# EasyEDA Pro project design.epro

# Schematic Schematic1
Board Name: Board1; Create Date: 2025-04-21; Page Name: P1; Project Name: EEPROM_PROG; Schematic Name: Schematic1; Update Date: 2025-04-21; Company: EasyEDA.com; Page Size: A4; Version: V1.0
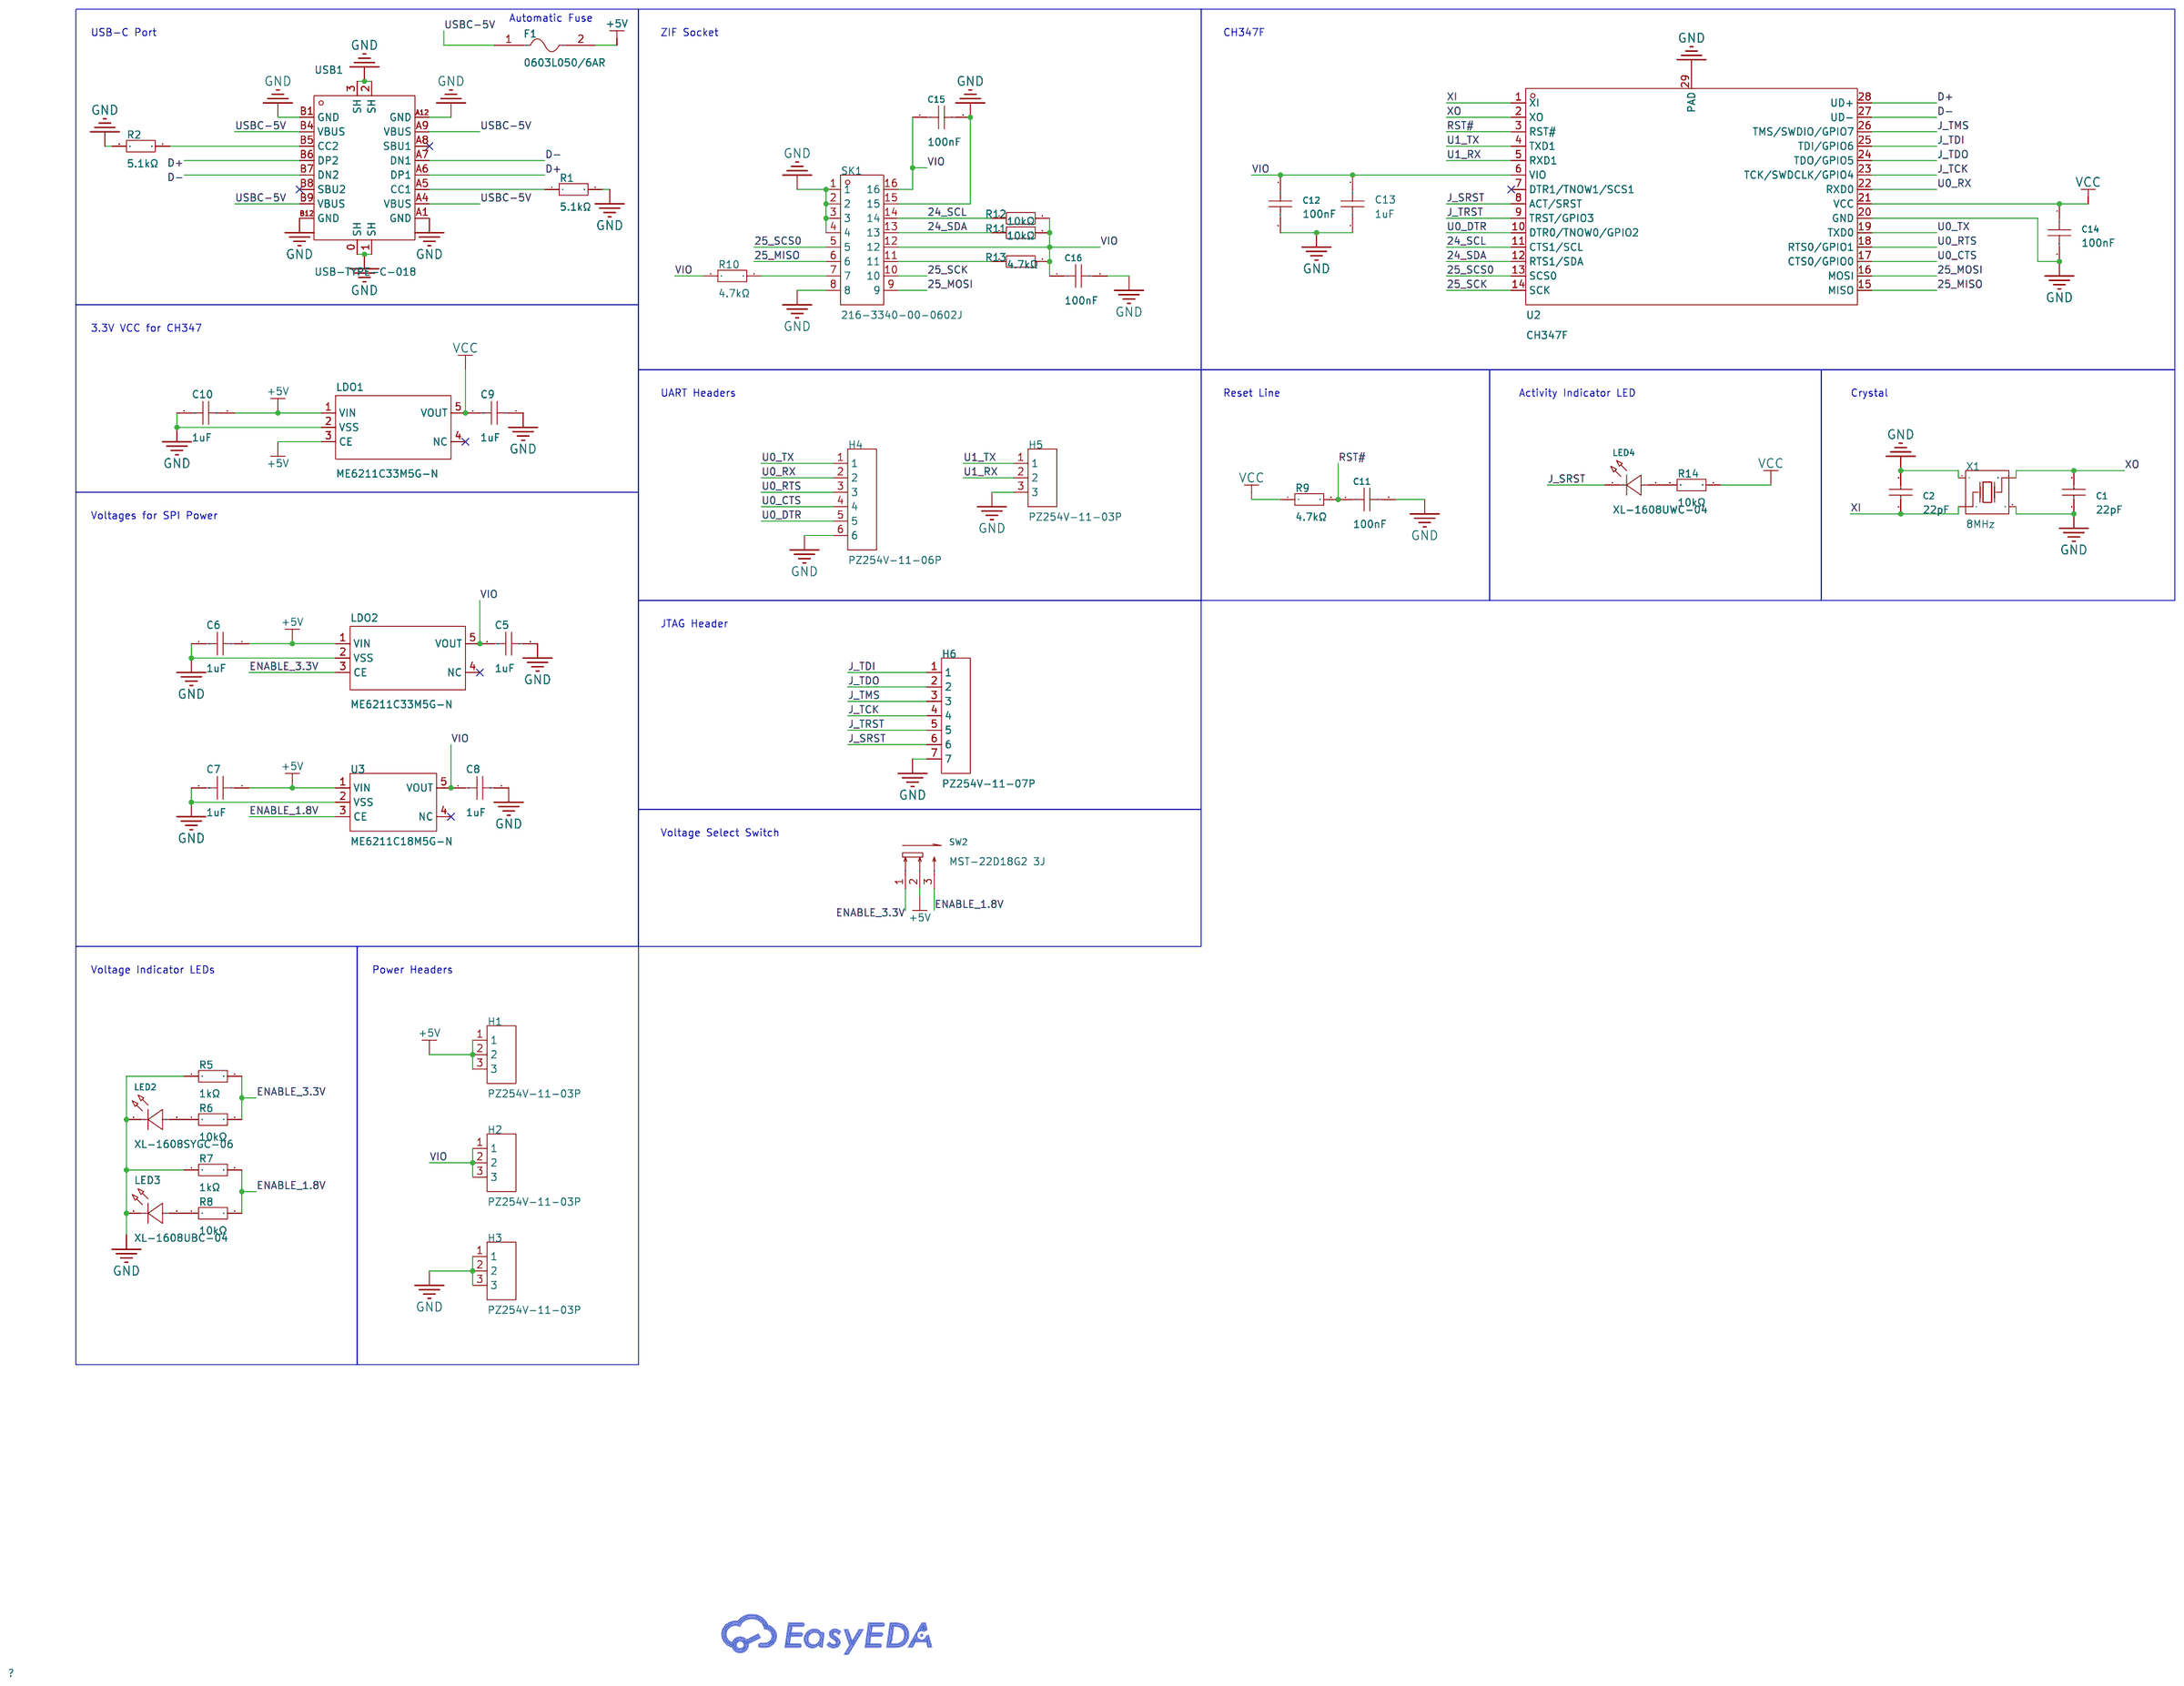
[diagram p0: schematic sheet]

## Parts
C1  22pF  [C0402]
C2  22pF  [C0402]
C5  1uF  [C0603]
C6  1uF  [C0603]
C7  1uF  [C0603]
C8  1uF  [C0603]
C9  1uF  [C0603]
C10  1uF  [C0603]
C11  100nF  [C0603]
C12  100nF  [C0603]
C13  1uF  [C0603]
C14  100nF  [C0603]
C15  100nF  [C0603]
C16  100nF  [C0603]
F1  0603L050/6AR  [F0603]
H1  PZ254V-11-03P  [HDR-TH_3P-P2.54-V-M]
H2  PZ254V-11-03P  [HDR-TH_3P-P2.54-V-M]
H3  PZ254V-11-03P  [HDR-TH_3P-P2.54-V-M]
H4  PZ254V-11-06P  [HDR-TH_6P-P2.54-V-M]
H5  PZ254V-11-03P  [HDR-TH_3P-P2.54-V-M]
H6  PZ254V-11-07P  [HDR-TH_7P-P2.54-V-M]
LDO1  ME6211C33M5G-N  [SOT-23-5_L3.0-W1.7-P0.95-LS2.8-BL]
LDO2  ME6211C33M5G-N  [SOT-23-5_L3.0-W1.7-P0.95-LS2.8-BL]
LED2  XL-1608SYGC-06  [LED0603-RD_GREEN]
LED3  XL-1608UBC-04  [LED0603-RD_BLUE]
LED4  XL-1608UWC-04  [LED0603-RD_WHITE]
R1  5.1kΩ  [R0603]
R2  5.1kΩ  [R0603]
R5  1kΩ  [R0603]
R6  10kΩ  [R0603]
R7  1kΩ  [R0603]
R8  10kΩ  [R0603]
R9  4.7kΩ  [R0603]
R10  4.7kΩ  [R0603]
R11  10kΩ  [R0603]
R12  10kΩ  [R0603]
R13  4.7kΩ  [R0603]
R14  10kΩ  [R0603]
SK1  216-3340-00-0602J  [DIP-16_216-3340-00-0602J]
SW2  MST-22D18G2 3J  [SW-SMD_SHOUHAN_MST-22D18G23J_C2875122]
U2  CH347F  [QFN-28_L4.0-W4.0-P0.40-BL-EP2.7]
U3  ME6211C18M5G-N  [SOT-23-5_L3.0-W1.7-P0.95-LS2.8-BR]
USB1  USB-TYPE-C-018  [USB-C_SMD-TYPE-C-31-M-12]
X1  8MHz  [CRYSTAL-SMD_4P-L3.2-W2.5-BL]

## Library data of the parts
C1 C2 = CC0402JRNPO9BN220: Capacitance: Tolerance:±5% Tolerance:±5% Voltage Rated: Temperature Coefficient:; LCSC Part Name: 22pF ±5% 50V; Supplier Part: C106203; Manufacturer: YAGEO(国巨); Supplier Footprint: 0402; JLCPCB Part Class: Extended Part; Datasheet: https://atta.szlcsc.com/upload/public/pdf/source/20170505/1493957838062.pdf; Supplier: LCSC; Tolerance: ±5%
C5-C10 C13 = CL10A105KB8NNNC: Capacitance: Tolerance:±10% Tolerance:±10% Voltage Rated: Temperature Coefficient:; LCSC Part Name: 1uF ±10% 50V; Supplier Part: C15849; Manufacturer: SAMSUNG(三星); Supplier Footprint: 0603; JLCPCB Part Class: Basic Part; Datasheet: https://atta.szlcsc.com/upload/public/pdf/source/20160218/1457707763339.pdf; Supplier: LCSC; Tolerance: ±10%
C11 C12 C14-C16 = CL10B104KB8NNNC: Capacitance: Tolerance:±10% Tolerance:±10% Voltage Rated: Temperature Coefficient:; LCSC Part Name: 100nF ±10% 50V; Supplier Part: C1591; Manufacturer: SAMSUNG(三星); Supplier Footprint: 0603; JLCPCB Part Class: Extended Part; Datasheet: https://atta.szlcsc.com/upload/public/pdf/source/20160218/1457707763339.pdf; Supplier: LCSC; Tolerance: ±10%
F1 = 0603L050/6AR: Operating Voltage (Max):6V Current Rating (Max):40A Hold Current:500mA Trip Current:1A Power Dissipation:500mW Resistance - Initial (Ri) (Min):100mΩ Resistance - Post Trip (R1) (Max):800mΩ Maximum Time to Trip:100ms Operating Temperature:-40℃~+85℃ Operati; LCSC Part Name: 6V 500mA 0603自恢复; Supplier Part: C7472536; Manufacturer: LUTE(陆特); Supplier Footprint: 0603; JLCPCB Part Class: Extended Part; Datasheet: https://atta.szlcsc.com/upload/public/pdf/source/20230807/696632CDD396EBD91087F7A9C6D2528B.pdf; Supplier: LCSC; Operating Voltage (Max): 6V; Current Rating (Max): 40A; Hold Current: 500mA; Trip Current: 1A; Power Dissipation: 500mW; Resistance - Initial (Ri) (Min): 100mΩ; Resistance - Post Trip (R1) (Max): 800mΩ; Maximum Time to Trip: 100ms; Operating Temperature: -40℃~+85℃
H1-H3 H5 = PZ254V-11-03P: Pin Structure:1x3P Pitch:2.54mm Row Spacing:- Circluar Pins/Square Pins:Policy Mounting Type:Straight Number of Rows:Single Row Number of Pins:3P Current Rating:3A Voltage Rating (Max):250V Length of Mating Pin:6mm Insulation Height:2.5mm Length of End Co; LCSC Part Name: 1x3P 间距:2.54mm 方针 直插; Supplier Part: C2937625; Manufacturer: XFCN(兴飞); Supplier Footprint: 插件,P=2.54mm; JLCPCB Part Class: Extended Part; Datasheet: https://atta.szlcsc.com/upload/public/pdf/source/20200309/C492402_8335C3D49C4E4C618838D59BB1D024C1.pdf; Supplier: LCSC; Pin Structure: 1x3P; Pitch: 2.54mm; Circluar Pins/Square Pins: Policy; Mounting Type: Straight; Number of Rows: Single Row; Number of Pins: 3P; Current Rating: 3A; Voltage Rating (Max): 250V; Length of Mating Pin: 6mm; Insulation Height: 2.5mm; Length of End Connection Pin: 3mm; Operating Temperature: -40℃~+105℃; Color: Black
H4 = PZ254V-11-06P: Pin Structure:1x6P Pitch:2.54mm Row Spacing:- Circluar Pins/Square Pins:Policy Mounting Type:Straight Number of Rows:Single Row Number of Pins:6P Current Rating:- Voltage Rating (Max):- Length of Mating Pin:6mm Insulation Height:2.5mm Length of End Connec; LCSC Part Name: 1x6P 间距:2.54mm 方针 直插; Supplier Part: C492405; Manufacturer: XFCN(兴飞); Supplier Footprint: 插件,P=2.54mm; JLCPCB Part Class: Extended Part; Datasheet: https://atta.szlcsc.com/upload/public/pdf/source/20200309/C492405_597F1930F5B55CC3C7FD95458F1C3977.pdf; Supplier: LCSC; Pin Structure: 1x6P; Pitch: 2.54mm; Circluar Pins/Square Pins: Policy; Mounting Type: Straight; Number of Rows: Single Row; Number of Pins: 6P; Length of Mating Pin: 6mm; Insulation Height: 2.5mm; Length of End Connection Pin: 3mm; Contact Material: Brass; Operating Temperature: -40℃~+105℃; Color: Black
H6 = PZ254V-11-07P: Pin Structure:1x7P Pitch:2.54mm Row Spacing:- Circluar Pins/Square Pins:Policy Mounting Type:Straight Number of Rows:Single Row Number of Pins:7P Current Rating:- Voltage Rating (Max):- Length of Mating Pin:6mm Insulation Height:2.5mm Length of End Connec; LCSC Part Name: 1x7P 间距:2.54mm 方针 直插; Supplier Part: C492406; Manufacturer: XFCN(兴飞); Supplier Footprint: 插件,P=2.54mm; JLCPCB Part Class: Extended Part; Datasheet: https://atta.szlcsc.com/upload/public/pdf/source/20200309/C492406_654C533EE691117E22DD9F76C114C2D9.pdf; Supplier: LCSC; Pin Structure: 1x7P; Pitch: 2.54mm; Circluar Pins/Square Pins: Policy; Mounting Type: Straight; Number of Rows: Single Row; Number of Pins: 7P; Length of Mating Pin: 6mm; Insulation Height: 2.5mm; Length of End Connection Pin: 3mm; Contact Material: Brass; Operating Temperature: -40℃~+105℃; Color: Black
LDO1 LDO2 = ME6211C33M5G-N: Output Type:Fixed Voltage - Supply:6V Output Voltage:3.3V Output Voltage:3.3V Output Current:500mA Power Supply Rejection Ratio (PSRR):70dB@(1kHz)；62dB@(10kHz) Voltage Dropout:260mV@(200mA) Features:Short-Circuit  Protection(SCP)；Low ESR；Overcurrent Prote; LCSC Part Name: 输入6V 输出3.3V 500mA; Supplier Part: C82942; Manufacturer: MICRONE(南京微盟); Supplier Footprint: SOT-23-5; JLCPCB Part Class: Extended Part; Datasheet: https://atta.szlcsc.com/upload/public/pdf/source/20170918/C82942_1505727073070976520.pdf; Supplier: LCSC; Output Type: Fixed; Voltage - Supply: 6V; Output Voltage: 3.3V; Output Current: 500mA; Power Supply Rejection Ratio (PSRR): 70dB@(1kHz)；62dB@(10kHz); Voltage Dropout: 260mV@(200mA); Features: Short-Circuit  Protection(SCP)；Low ESR；Overcurrent Protection(OCP)；With ability; Output Configuration: Positive electrode; Number of Outputs: 1
LED2 = XL-1608SYGC-06: Emitted Color:Green-yellow Power Dissipation:55mW Forward Current:25mA Dominant Wavelength:570nm~573nm Dominant Wavelength:570nm~573nm Peak Wavelength:575nm Lens Color:无色透明透镜 Color Temperature:2800K~3160K Color Temperature:2800K~3160K Viewing Angle:120° M; Supplier Part: C965805; Manufacturer: XINGLIGHT(成兴光); Supplier Footprint: 0603; JLCPCB Part Class: Extended Part; Datasheet: https://atta.szlcsc.com/upload/public/pdf/source/20221102/F362183196D461585F90F08511E6DE2E.pdf; Supplier: LCSC; Emitted Color: Green-yellow; Power Dissipation: 55mW; Forward Current: 25mA; Dominant Wavelength: 570nm~573nm; Peak Wavelength: 575nm; Lens Color: 无色透明透镜; Color Temperature: 2800K~3160K; Viewing Angle: 120°; Mounting Sytle: Positive post; Operating Temperature: -30℃~+85℃
LED3 = XL-1608UBC-04: Lamp Holder Type:- Illumination Color:Blue Voltage - Forward(Vf):3.3V Voltage - Forward(Vf):3.3V Power(Watts):70mW Forward Current:20mA Wavelength - Dominant:455nm~475nm Wavelength - Dominant:455nm~475nm Peak Wavelength:470nm Diode Configuration:- Lens Co; Supplier Part: C965807; Manufacturer: XINGLIGHT(成兴光); Supplier Footprint: 0603; JLCPCB Part Class: Extended Part; Datasheet: https://atta.szlcsc.com/upload/public/pdf/source/20250213/9D28F40E58C3285D8CA3C7212E2FBA3B.pdf; Supplier: LCSC; Illumination Color: Blue; Voltage - Forward(Vf): 3.3V; Power(Watts): 70mW; Forward Current: 20mA; Wavelength - Dominant: 455nm~475nm; Peak Wavelength: 470nm; Lens Color: Colorless Transparent Lens; Luminous Intensity: 300mcd; Viewing Angle: 120°; Mounting Sytle: Positive Stick; Operating Temperature: -20℃~+85℃
LED4 = XL-1608UWC-04: Emitted Color:White Power Dissipation:80mW Forward Current:25mA Dominant Wavelength:- Dominant Wavelength:- Lens Color:黄色透镜 Color Temperature:13700K~19000K Color Temperature:13700K~19000K Viewing Angle:120° Mounting Sytle:Positive post Operating Temperatu; Supplier Part: C965808; Manufacturer: XINGLIGHT(成兴光); Supplier Footprint: 0603; JLCPCB Part Class: Extended Part; Datasheet: https://atta.szlcsc.com/upload/public/pdf/source/20221102/585FFDAF9A16AAB1CA7BDF9640D81A72.pdf; Supplier: LCSC; Emitted Color: White; Power Dissipation: 80mW; Forward Current: 25mA; Lens Color: 黄色透镜; Color Temperature: 13700K~19000K; Viewing Angle: 120°; Mounting Sytle: Positive post; Operating Temperature: -30℃~+85℃
R1 R2 = RC0603FR-075K1L: Type:Thick Film Resistors Resistance: Tolerance:±1% Tolerance:±1% Power(Watts): Overload Voltage (Max): Temperature Coefficient:±100ppm/℃ Temperature Coefficient:±100ppm/℃ Operating Temperature Range:-55℃~+155℃ Operating Temperature Range:-55℃~+155℃; LCSC Part Name: 厚膜电阻 5.1kΩ ±1% 100mW; Supplier Part: C105580; Manufacturer: YAGEO(国巨); Supplier Footprint: 0603; JLCPCB Part Class: Extended Part; Datasheet: https://atta.szlcsc.com/upload/public/pdf/source/20180316/70C0E2BDAE7FCC62C531A5A58D202EE1.pdf; Supplier: LCSC; Type: Thick Film Resistors; Tolerance: ±1%; Temperature Coefficient: ±100ppm/℃; Operating Temperature Range: -55℃~+155℃
R5 R7 = RC0603FR-071KL: Type:Thick Film Resistors Resistance: Tolerance:±1% Tolerance:±1% Power(Watts): Overload Voltage (Max): Temperature Coefficient:±100ppm/℃ Temperature Coefficient:±100ppm/℃ Operating Temperature Range:-55℃~+155℃ Operating Temperature Range:-55℃~+155℃; LCSC Part Name: 厚膜电阻 1kΩ ±1% 100mW; Supplier Part: C22548; Manufacturer: YAGEO(国巨); Supplier Footprint: 0603; JLCPCB Part Class: Extended Part; Datasheet: https://atta.szlcsc.com/upload/public/pdf/source/20180316/70C0E2BDAE7FCC62C531A5A58D202EE1.pdf; Supplier: LCSC; Type: Thick Film Resistors; Tolerance: ±1%; Temperature Coefficient: ±100ppm/℃; Operating Temperature Range: -55℃~+155℃
R6 R8 R11 R12 R14 = RC0603FR-0710KL: Type:Thick Film Resistors Resistance: Tolerance:±1% Tolerance:±1% Power(Watts): Overload Voltage (Max): Temperature Coefficient:±100ppm/℃ Temperature Coefficient:±100ppm/℃ Operating Temperature Range:-55℃~+155℃ Operating Temperature Range:-55℃~+155℃; LCSC Part Name: 厚膜电阻 10kΩ ±1% 100mW; Supplier Part: C98220; Manufacturer: YAGEO(国巨); Supplier Footprint: 0603; JLCPCB Part Class: Extended Part; Datasheet: https://atta.szlcsc.com/upload/public/pdf/source/20180927/C295883_E8D83085EA81BD7DE0B2B681138C15EE.pdf; Supplier: LCSC; Type: Thick Film Resistors; Tolerance: ±1%; Temperature Coefficient: ±100ppm/℃; Operating Temperature Range: -55℃~+155℃
R9 R10 R13 = RC0603FR-074K7L: Type:Thick Film Resistors Resistance: Tolerance:±1% Tolerance:±1% Power(Watts): Overload Voltage (Max): Temperature Coefficient:±100ppm/℃ Temperature Coefficient:±100ppm/℃ Operating Temperature Range:-55℃~+155℃ Operating Temperature Range:-55℃~+155℃; LCSC Part Name: 厚膜电阻 4.7kΩ ±1% 100mW; Supplier Part: C99782; Manufacturer: YAGEO(国巨); Supplier Footprint: 0603; JLCPCB Part Class: Extended Part; Datasheet: https://atta.szlcsc.com/upload/public/pdf/source/20180224/C181757_15194369480721363983.pdf; Supplier: LCSC; Type: Thick Film Resistors; Tolerance: ±1%; Temperature Coefficient: ±100ppm/℃; Operating Temperature Range: -55℃~+155℃
SK1 = 216-3340-00-0602J: Adaptation Package Type:DIP Pitch:2.54mm Number of Positions:16P Contact Material:Beryllium Copper Alloy Contact Plating:Gold Operating Temperature Range:-55℃~+125℃ Operating Temperature Range:-55℃~+125℃; LCSC Part Name: 间距2.54mm P数:16P; Supplier Part: C6991222; Manufacturer: 3M; JLCPCB Part Class: Extended Part; Datasheet: https://atta.szlcsc.com/upload/public/pdf/source/231023/ts0365.pdf-cbf6893fd130cb30d38040eae81f9e8a.pdf; Supplier: LCSC; Adaptation Package Type: DIP; Pitch: 2.54mm; Number of Positions: 16P; Contact Material: Beryllium Copper Alloy; Contact Plating: Gold; Operating Temperature Range: -55℃~+125℃
SW2 = MST-22D18G2 3J: Circuit:SPDT Actuator Style:- Pin Style:SMDSplicing Switch Length:9.1mm Switch Width:3.6mm Switch Height:3.45mm Mounting Style:Brick nogging Actuator Color:- Current Rating (DC):50mA Voltage Rating (DC):12V Current Rating (AC):- Voltage Rating (AC):- Mech; LCSC Part Name: 拨动开关 2档3脚立式贴片 柄高2MM 9.1*3.5*2.0mm; Supplier Part: C2875122; Manufacturer: SHOU HAN(首韩); Supplier Footprint: SMD; JLCPCB Part Class: Extended Part; Supplier: LCSC; Circuit: SPDT; Pin Style: SMDSplicing; Switch Length: 9.1mm; Switch Width: 3.6mm; Switch Height: 3.45mm; Mounting Style: Brick nogging; Current Rating (DC): 50mA; Voltage Rating (DC): 12V; Mechanical Life: 1万次; Operating Temperature: -30℃~+80℃
U2 = CH347F: Supplier Part: C18221627; Manufacturer: WCH(南京沁恒); Supplier Footprint: QFN-28(4X4); JLCPCB Part Class: Extended Part; Datasheet: https://atta.szlcsc.com/upload/public/pdf/source/20240509/DA904CF7D01ABEB901126CAEC63895CB.pdf; Supplier: LCSC
U3 = ME6211C18M5G-N: Output Type:Fixed Voltage - Supply:6.5V Output Voltage:1.8V Output Voltage:1.8V Output Current:300mA Power Supply Rejection Ratio (PSRR):70dB@(1kHz) Voltage Dropout:400mV@(200mA) Features:Overcurrent Protection(OCP) Output Configuration:Positive electrode; LCSC Part Name: 输入6.5V 输出1.8V 300mA; Supplier Part: C236671; Manufacturer: MICRONE(南京微盟); Supplier Footprint: SOT-23-5; JLCPCB Part Class: Extended Part; Datasheet: https://atta.szlcsc.com/upload/public/pdf/source/20180801/C94042_8FDAFF138ADDED65E3D077205E9A8C17.pdf; Supplier: LCSC; Output Type: Fixed; Voltage - Supply: 6.5V; Output Voltage: 1.8V; Output Current: 300mA; Power Supply Rejection Ratio (PSRR): 70dB@(1kHz); Voltage Dropout: 400mV@(200mA); Features: Overcurrent Protection(OCP); Output Configuration: Positive electrode; Number of Outputs: 1
USB1 = USB-TYPE-C-018: Connector Type:Type-C Standard:- Gender:Female Mounting Style:Horizontal attachment Number of Contacts:16P Number of Ports:1 Current Rating - Power (Max):3A Operating Temperature Range:-25℃~+85℃ Operating Temperature Range:-25℃~+85℃; LCSC Part Name: Type-C 母 卧贴; Supplier Part: C2927038; Manufacturer: DEALON(德艺隆); Supplier Footprint: SMD; JLCPCB Part Class: Extended Part; Datasheet: https://atta.szlcsc.com/upload/public/pdf/source/20211217/CCD3D517E355E8E0CC52ABD8D5784AD8.pdf; Supplier: LCSC; Connector Type: Type-C; Gender: Female; Mounting Style: Horizontal attachment; Number of Contacts: 16P; Number of Ports: 1; Current Rating - Power (Max): 3A; Operating Temperature Range: -25℃~+85℃
X1 = TAXM8M4RDBCCT2T: Type:Surface Mount Crystal Frequency:8MHz Normal temperature Frequency Tolerance:±10ppm Normal temperature Frequency Tolerance:±10ppm Load Capacitance: Frequency Stability:±15ppm Frequency Stability:±15ppm Equivalent Series Resistance(ESR):250Ω Operating; LCSC Part Name: 8MHz ±10ppm 10pF; Supplier Part: C400090; Manufacturer: YJX(雅晶鑫); Supplier Footprint: SMD3225-4P; JLCPCB Part Class: Extended Part; Datasheet: https://atta.szlcsc.com/upload/public/pdf/source/20190626/C400090_CF95B89E745AFE4EF2E392EF8AC009D6.pdf; Supplier: LCSC; Type: Surface Mount Crystal; Normal temperature Frequency Tolerance: ±10ppm; Frequency Stability: ±15ppm; Equivalent Series Resistance(ESR): 250Ω; Operating Temperature: -40℃~+85℃

## Nets
+5V: C6.1 C7.1 C10.1 F1.2 H1.1 H1.2 H1.3 LDO1.1(VIN) LDO1.3(CE) LDO2.1(VIN) SW2.2 U3.1(VIN)
GND: C1.1 C2.2 C5.1 C6.2 C7.2 C8.1 C9.1 C10.2 C11.2 C12.2 C13.2 C14.2 C15.2 C16.2 H3.1 H3.2 H3.3 H4.6 H5.3 H6.7 LDO1.2(VSS) LDO2.2(VSS) LED2.1(K) LED3.1(K) R1.2 R2.1 R5.1 R7.1 SK1.1 SK1.2 SK1.3 SK1.4 SK1.8 SK1.15 U2.20(GND) U2.29(PAD) U3.2(VSS) USB1.0(SH) USB1.1(SH) USB1.2(SH) USB1.3(SH) USB1.A1(GND) USB1.A12(GND) USB1.B1(GND) USB1.B12(GND) X1.2 X1.4
VCC: C9.2 C14.1 LDO1.5(VOUT) R9.1 R14.2 U2.21(VCC)
24_SCL: R12.1 SK1.14 U2.11(CTS1/SCL)
24_SDA: R11.1 SK1.13 U2.12(RTS1/SDA)
25_MISO: SK1.6 U2.15(MISO)
25_MOSI: SK1.9 U2.16(MOSI)
25_SCK: SK1.10 U2.14(SCK)
25_SCS0: SK1.5 U2.13(SCS0)
D+: U2.28(UD+) USB1.A6(DP1) USB1.B6(DP2)
D-: U2.27(UD-) USB1.A7(DN1) USB1.B7(DN2)
ENABLE_1.8V: R7.2 R8.2 SW2.3 U3.3(CE)
ENABLE_3.3V: LDO2.3(CE) R5.2 R6.2 SW2.1
J_SRST: H6.6 LED4.1(K) U2.8(ACT/SRST)
J_TCK: H6.4 U2.23(TCK/SWDCLK/GPIO4)
J_TDI: H6.1 U2.25(TDI/GPIO6)
J_TDO: H6.2 U2.24(TDO/GPIO5)
J_TMS: H6.3 U2.26(TMS/SWDIO/GPIO7)
J_TRST: H6.5 U2.9(TRST/GPIO3)
RST#: C11.1 R9.2 U2.3(RST#)
U0_CTS: H4.4 U2.17(CTS0/GPIO0)
U0_DTR: H4.5 U2.10(DTR0/TNOW0/GPIO2)
U0_RTS: H4.3 U2.18(RTS0/GPIO1)
U0_RX: H4.2 U2.22(RXD0)
U0_TX: H4.1 U2.19(TXD0)
U1_RX: H5.2 U2.5(RXD1)
U1_TX: H5.1 U2.4(TXD1)
USBC-5V: F1.1 USB1.A4(VBUS) USB1.A9(VBUS) USB1.B4(VBUS) USB1.B9(VBUS)
VIO: C5.2 C8.2 C12.1 C13.1 C15.1 C16.1 H2.1 H2.2 H2.3 LDO2.5(VOUT) R10.1 R11.2 R12.2 R13.2 SK1.12 SK1.16 U2.6(VIO) U3.5(VOUT)
XI: C2.1 U2.1(XI) X1.1
XO: C1.2 U2.2(XO) X1.3
$1N3218: R1.1 USB1.A5(CC1)
$1N3257: R2.2 USB1.B5(CC2)
$1N4164: LED2.2(A) R6.1
$1N4166: LED3.2(A) R8.1
$1N5733: R10.2 SK1.7
$1N6054: R13.1 SK1.11
$1N7010: LED4.2(A) R14.1

Not connected (* = marked no-connect by the designer): LDO1 4(NC)*; LDO2 4(NC)*; U2 7(DTR1/TNOW1/SCS1)*; U3 4(NC)*; USB1 A8(SBU1)* B8(SBU2)*

## Notes on the sheet
- Automatic Fuse
- USB-C Port
- ZIF Socket
- CH347F
- 3.3V VCC for CH347
- UART Headers
- Reset Line
- Activity Indicator LED
- Crystal
- Voltages for SPI Power
- JTAG Header
- Voltage Select Switch
- Voltage Indicator LEDs
- Power Headers

# Board PCB1
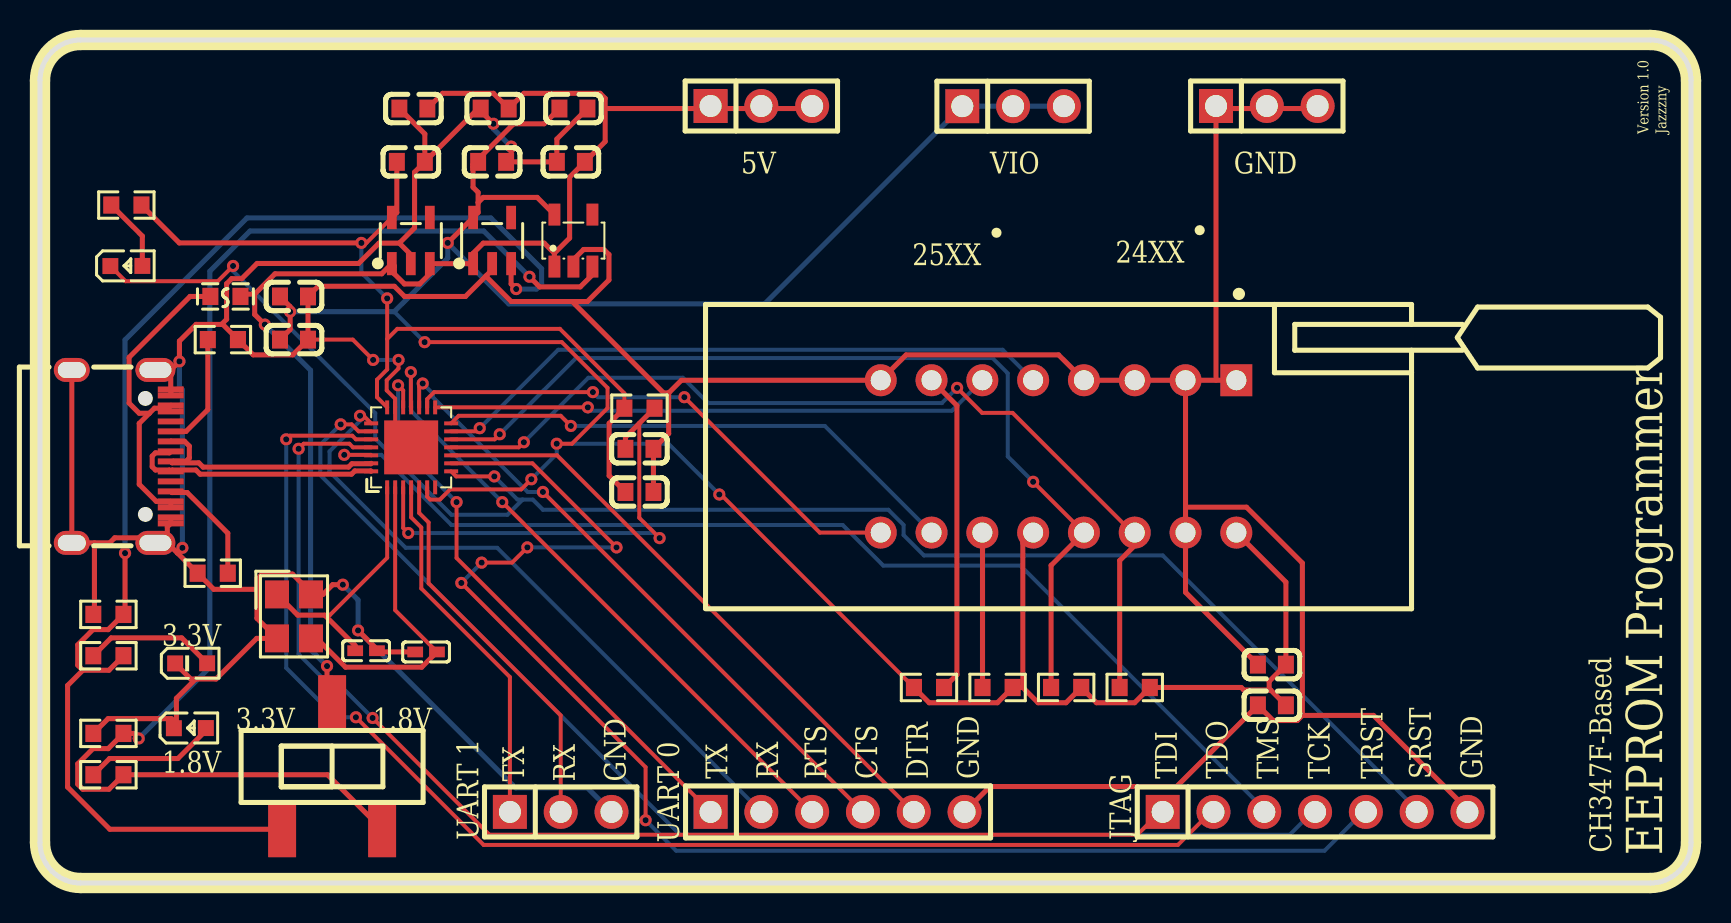
[diagram p1: board, top side]
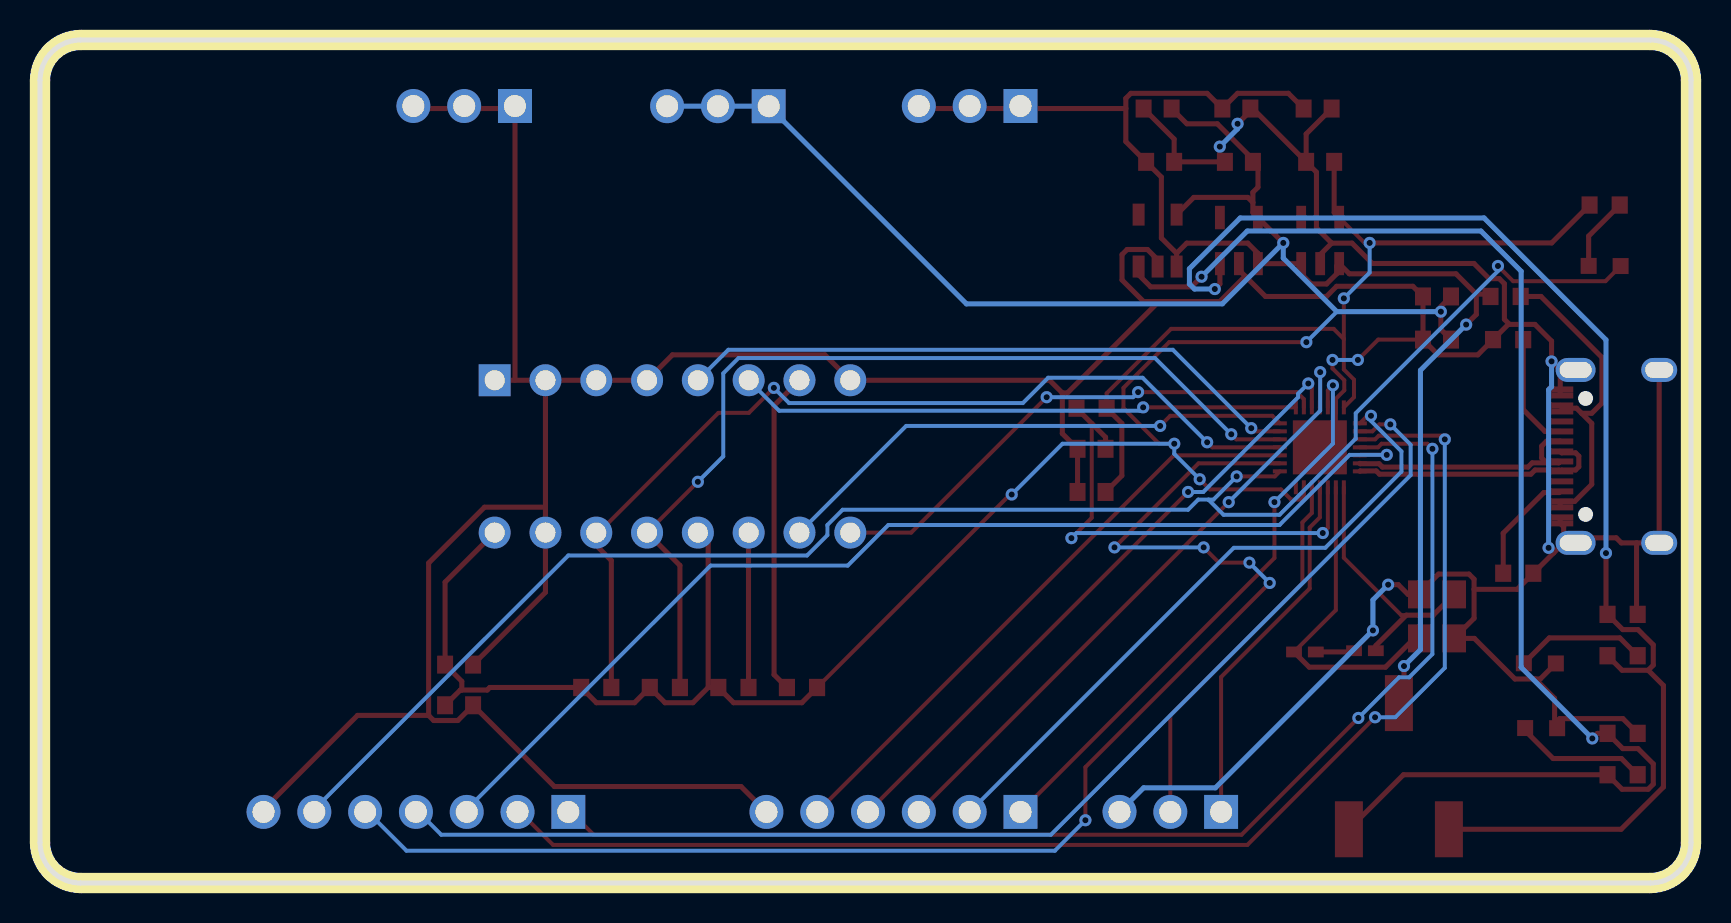
[diagram p2: board, bottom side, seen from below]

Outline 82.55 x 42.16 mm; copper layers: Top Layer, Bottom Layer. Coordinates in mm from the lower left corner of the outline.
Outline path: 0,40.13 0,2.03 arc(0.6,0.6) 2.03,0 80.52,0 arc(81.95,0.6) 82.55,2.03 82.55,40.13 arc(81.95,41.57) 80.52,42.16 2.03,42.16 arc(0.6,41.57) 0,40.13
Stack: Top Layer 0.035mm / Dielectric1 1.51mm FR4 er 4.5 / Bottom Layer 0.035mm

## Design rules (mm)
template: JLCPCB Capability(Two Layers Board)
spacing copperThickness1oz (default): track to track 0.102, other pairs 0.152 to 0.3
spacing copperThickness2oz: track to track 0.203, other pairs 0.152 to 0.3
track width copperThickness1oz (default): min 0.127, default 0.254, max 2.54
track width copperThickness2oz: min 0.203, default 0.254, max 2.54
differential pair differentialPair (default): width min 0.127, default 0.254, max 2.54; gap min 0.152, default 0.152
via viaSize (default): diameter min 0.5, default 0.61, max 10; hole min 0.3, default 0.305, max 6.3

## Placement (name value [footprint] x y rotation side)
C1  22pF  [C0402]  19.3 11.56 0 top
C2  22pF  [C0402]  16.3 11.62 0 top
C5  1uF  [C0603]  22.61 36.07 180 top
C6  1uF  [C0603]  22.73 38.73 180 top
C7  1uF  [C0603]  26.54 36.07 180 top
C8  1uF  [C0603]  26.67 38.73 180 top
C9  1uF  [C0603]  18.54 36.07 180 top
C10  1uF  [C0603]  18.67 38.73 180 top
C11  100nF  [C0603]  29.97 21.72 0 top
C12  100nF  [C0603]  12.7 27.18 0 top
C13  1uF  [C0603]  12.7 29.34 0 top
C14  100nF  [C0603]  29.97 19.56 0 top
C15  100nF  [C0603]  61.6 8.89 180 top
C16  100nF  [C0603]  61.6 10.92 180 top
F1  0603L050/6AR  [F0603]  9.27 29.34 0 top
H1  PZ254V-11-03P  [HDR-TH_3P-P2.54-V-M]  36.07 38.86 0 top
H2  PZ254V-11-03P  [HDR-TH_3P-P2.54-V-M]  48.65 38.85 0 top
H3  PZ254V-11-03P  [HDR-TH_3P-P2.54-V-M]  61.34 38.86 0 top
H4  PZ254V-11-06P  [HDR-TH_6P-P2.54-V-M]  39.88 3.56 0 top
H5  PZ254V-11-03P  [HDR-TH_3P-P2.54-V-M]  26.04 3.56 0 top
H6  PZ254V-11-07P  [HDR-TH_7P-P2.54-V-M]  63.75 3.56 0 top
LDO1  ME6211C33M5G-N  [SOT-23-5_L3.0-W1.7-P0.95-LS2.8-BL]  18.54 32.13 0 top
LDO2  ME6211C33M5G-N  [SOT-23-5_L3.0-W1.7-P0.95-LS2.8-BL]  22.61 32.13 0 top
LED2  XL-1608SYGC-06  [LED0603-RD_GREEN]  7.56 10.99 0 top
LED3  XL-1608UBC-04  [LED0603-RD_BLUE]  7.49 7.75 0 top
LED4  XL-1608UWC-04  [LED0603-RD_WHITE]  4.32 30.86 0 top
R1  5.1kΩ  [R0603]  9.14 27.18 0 top
R2  5.1kΩ  [R0603]  8.64 15.49 0 top
R5  1kΩ  [R0603]  3.42 13.44 0 top
R6  10kΩ  [R0603]  3.42 11.37 0 top
R7  1kΩ  [R0603]  3.42 7.48 0 top
R8  10kΩ  [R0603]  3.42 5.42 0 top
R9  4.7kΩ  [R0603]  29.97 23.75 0 top
R10  4.7kΩ  [R0603]  44.45 9.78 0 top
R11  10kΩ  [R0603]  51.31 9.78 0 top
R12  10kΩ  [R0603]  54.74 9.78 0 top
R13  4.7kΩ  [R0603]  47.88 9.78 0 top
R14  10kΩ  [R0603]  4.32 33.91 0 top
SK1  216-3340-00-0602J  [DIP-16_216-3340-00-0602J]  50.93 21.34 0 top
SW2  MST-22D18G2 3J  [SW-SMD_SHOUHAN_MST-22D18G23J_C2875122]  14.61 5.84 0 top
U2  CH347F  [QFN-28_L4.0-W4.0-P0.40-BL-EP2.7]  18.56 21.79 0 top
U3  ME6211C18M5G-N  [SOT-23-5_L3.0-W1.7-P0.95-LS2.8-BR]  26.67 32.13 270 top
USB1  USB-TYPE-C-018  [USB-C_SMD-TYPE-C-31-M-12]  4.06 21.34 270 top
X1  8MHz  [CRYSTAL-SMD_4P-L3.2-W2.5-BL]  12.7 13.34 270 top

## Footprints (pads in the part's own frame, mm; a bottom-side part is the same pattern mirrored in y, then rotated)
C0402
  rect 0.79x0.54 smd: 1(-0.545,0) 2(0.545,0)
C0603
  rect 0.8x0.9 smd: 1(-0.7,0) 2(0.7,0)
CRYSTAL-SMD_4P-L3.2-W2.5-BL
  rect 1.4x1.2 smd: 1(-1.1,-0.85) 2(1.1,-0.85) 3(1.1,0.85) 4(-1.1,0.85)
DIP-16_216-3340-00-0602J
  rect 1.6x1.6 hole 1: 1(8.89,3.81)
  round 1.6 hole 1: 2(6.35,3.81) 3(3.81,3.81) 4(1.27,3.81) 5(-1.27,3.81) 6(-3.81,3.81) 7(-6.35,3.81) 8(-8.89,3.81) 9(-8.89,-3.81) 10(-6.35,-3.81) 11(-3.81,-3.81) 12(-1.27,-3.81) 13(1.27,-3.81) 14(3.81,-3.81) 15(6.35,-3.81) 16(8.89,-3.81)
F0603
  rect 0.806x0.864 smd: 1(-0.753,0) 2(0.753,0)
HDR-TH_3P-P2.54-V-M
  rect 1.7x1.7 hole 1.1: 1(-2.54,0)
  round 1.7 hole 1.1: 2(0,0) 3(2.54,0)
HDR-TH_6P-P2.54-V-M
  rect 1.7x1.7 hole 1.1: 1(-6.35,0)
  round 1.7 hole 1.1: 2(-3.81,0) 3(-1.27,0) 4(1.27,0) 5(3.81,0) 6(6.35,0)
HDR-TH_7P-P2.54-V-M
  rect 1.7x1.7 hole 1.1: 1(-7.62,0)
  round 1.7 hole 1.1: 2(-5.08,0) 3(-2.54,0) 4(0,0) 5(2.54,0) 6(5.08,0) 7(7.62,0)
LED0603-RD_BLUE
  rect 0.8x0.8 smd: 1(-0.799,-0.004) 2(0.799,0.004)
LED0603-RD_GREEN
  rect 0.8x0.8 smd: 1(-0.799,-0.004) 2(0.799,0.004)
LED0603-RD_WHITE
  rect 0.8x0.8 smd: 1(-0.799,-0.004) 2(0.799,0.004)
QFN-28_L4.0-W4.0-P0.40-BL-EP2.7
  rect 0.2x0.7 smd: 1(-1.2,-2) 2(-0.8,-2) 3(-0.4,-2) 4(-0.001,-2) 5(0.4,-2) 6(0.8,-2) 7(1.2,-2) 15(1.2,2) 16(0.8,2) 17(0.4,2) 18(0,2) 19(-0.4,2) 20(-0.8,2) 21(-1.2,2)
  rect 0.7x0.2 smd: 8(2,-1.2) 9(2,-0.8) 10(2,-0.4) 11(1.999,0) 12(2,0.4) 13(2,0.8) 14(2,1.2) 22(-2,1.2) 23(-2,0.8) 24(-2,0.4) 25(-2,0) 26(-2,-0.4) 27(-2,-0.8) 28(-2,-1.2)
  rect 2.7x2.7 smd: 29(0.001,0)
R0603
  rect 0.806x0.864 smd: 1(-0.753,0) 2(0.753,0)
SOT-23-5_L3.0-W1.7-P0.95-LS2.8-BL
  rect 0.49x1.157 smd: 1(-0.95,-1.153) 2(0,-1.153) 3(0.95,-1.153)
  rect 0.49x1.175 smd: 4(0.95,1.153) 5(-0.95,1.153)
SOT-23-5_L3.0-W1.7-P0.95-LS2.8-BR
  rect 1.1x0.6 smd: 1(1.3,-0.95) 2(1.3,0) 3(1.3,0.95) 4(-1.3,0.95) 5(-1.3,-0.95)
SW-SMD_SHOUHAN_MST-22D18G23J_C2875122
  rect 1.4x2.8 smd: 1(-2.5,-3.155) 2(0,3.155) 3(2.5,-3.155)
USB-C_SMD-TYPE-C-31-M-12
  oval 1.2x2 hole 0.8x1.6: 0(-4.325,1.706) 1(4.325,1.706)
  oval 1.2x1.8 hole 0.8x1.4: 2(4.325,-2.474) 3(-4.325,-2.474)
  rect 0.3x1.3 smd: A1(-3.35,2.474) A4(-2.55,2.474) A5(-1.25,2.474) A6(-0.25,2.474) A7(0.25,2.474) A8(1.25,2.474) A9(2.55,2.474) A12(3.35,2.474) B1(3.05,2.474) B4(2.25,2.474) B5(1.75,2.474) B6(0.75,2.474) B7(-0.75,2.474) B8(-1.75,2.474) B9(-2.25,2.474) B12(-3.05,2.474)

## Nets
As in the schematic.

Pads without a net: LDO1 4; LDO2 4; U2 7; U3 4; USB1 A8 B8

## Via types
v1: diameter 0.61, hole 0.305, Top Layer to Bottom Layer, 53 vias

## Routing (per net, layer and track width the routed paths; a pad name or vN(x,y) marks a point on that pad's centre or on a via; arc(x,y) is an arc through that point)
+5V: length 70.5
  Top Layer w0.254: 28.26,38.73 38.61,38.73 ; 28.26,38.73 28.26,37.08 C7.1 26.48,35.31 26.48,32.26 25.72,31.5 ; 28.26,38.73 28.26,39.24 28.01,39.5 24.2,39.5 C6.1 22.67,39.5 20.13,39.5 C10.1 ; F1.2 10.14,29.45 10.73,29.45 ; 10.73,29.45 10.73,28.44 v1(11.24,27.93) ; 10.73,29.45 11.75,30.47 17.08,30.47 LDO1.1 17.71,30.86 17.71,30.47 18.22,29.96 18.98,29.96 19.49,30.47 LDO1.3 21.66,30.98 21.66,31.5 22.16,32 25.21,32 25.72,31.5 ; 14.61,9 14.35,9.25 v1(14.35,10.85) ; 25.72,31.5 U3.1
  Bottom Layer w0.254: v1(14.35,10.85) 13.53,11.67 13.53,25.64 v1(11.24,27.93)
GND: length 277.6
  Top Layer w0.2: U2.29 17.76,22.59 U2.20 17.76,24.22 17.34,24.64 17.34,25.15 17.93,25.74 v1(17.93,26.16) ; C12.2 15.64,27.18 v1(16.66,26.16)
  Top Layer w0.254: SK1.2 SK1.1 ; SK1.2 SK1.3 SK1.4 50.93,26.42 43.31,26.42 SK1.8 32.07,25.15 31.43,24.51 ; SK1.2 57.28,18.8 ; 16.92,11.62 16.98,11.56 C1.1 ; 16.92,11.62 C2.2 ; 16.92,11.62 v1(15.9,12.63) ; 13.64,14.44 12.62,15.45 11.1,15.45 10.85,15.2 10.85,14.69 ; 13.64,14.44 14.15,14.44 14.63,14.92 v1(15.14,14.92) ; 13.64,14.44 13.55,14.44 ; LDO2.2 22.61,30.67 22.29,30.35 ; 6.37,17.01 6.37,17.81 USB1.A12 USB1.B1 ; 6.37,17.01 USB1.1 5.52,17.27 3.74,17.27 3.48,17.01 2.72,17.01 ; 6.37,17.01 6.87,16.51 ; 6.82,7.97 6.82,7.74 ; 6.82,7.97 6.82,9.24 7.79,10.2 ; 6.82,7.97 6.57,8.22 3.4,8.22 2.67,7.48 ; 58.8,25.15 58.8,38.73 63.88,38.73 ; 26.61,29.08 23.56,29.08 22.29,30.35 ; 26.61,29.08 31.18,24.51 31.43,24.51 ; 26.61,29.08 27.37,29.08 28.45,30.16 28.45,31.43 28.19,31.69 27.18,31.69 26.67,31.18 U3.2 ; C14.2 C11.2 31.43,22.48 31.43,24.51 ; 71.37,3.68 66.67,8.38 63.12,8.38 ; 9.08,27.94 9.14,27.94 R1.2 10.66,26.42 12.64,26.42 C12.2 C13.2 13.91,29.85 17.72,29.85 18.23,29.34 21.27,29.34 22.29,30.35 ; 9.08,27.94 7.81,27.94 6.97,27.11 v1(6.97,26.09) 6.54,25.66 ; 9.08,27.94 9.33,28.19 9.33,29.97 9.58,30.23 10.09,30.23 10.85,30.99 15.93,30.99 16.95,32 17.97,32 ; 6.87,16.51 R2.1 8.69,14.69 10.85,14.69 ; 6.87,16.51 v1(7.12,16.76) ; C9.1 19.24,37.46 C10.2 ; C9.1 21.91,38.73 ; C9.1 18.73,35.55 18.73,32.77 17.97,32 ; 63.12,8.38 62.86,8.13 61.66,8.13 C15.2 56.83,4.83 47.5,4.83 H4.6 ; 63.12,8.38 63.12,16 60.33,18.8 57.28,18.8 ; 21.91,38.73 v1(22.67,37.97) ; 21.91,38.73 C6.2 ; 10.85,14.69 10.85,13.24 X1.2 10.83,12.23 8.8,10.2 7.79,10.2 ; 6.76,10.98 7.54,10.2 7.79,10.2 ; 57.28,18.8 SK1.15 57.28,14.54 C16.2 ; 17.97,32 18.54,31.43 LDO1.2 ; v1(23.56,36.83) 23.56,36.32 C5.1 C7.2 25.84,37.21 27.37,38.73 ; 2.67,13.44 2.72,13.49 2.72,17.01 ; 2.72,17.01 USB1.2 1.59,25.66 ; USB1.B12 USB1.A1 6.54,25.66 ; 6.54,25.66 5.78,25.66
  Bottom Layer w0.2: v1(16.66,26.16) v1(17.93,26.16)
  Bottom Layer w0.254: v1(22.67,37.97) 22.67,37.72 v1(23.56,36.83) ; v1(15.14,14.92) 15.9,14.16 v1(15.9,12.63) 23.78,4.76 27.37,4.76 H5.3 ; v1(6.97,26.09) 6.97,24.82 7.12,24.67 v1(7.12,16.76)
VCC: length 44.9
  Top Layer w0.2: v1(16.07,32.01) 16.32,32.01 LDO1.5 ; R9.1 29.22,24.49 25.99,27.72 17.87,27.72 17.36,27.21 ; 17.36,27.21 v1(17.36,29.24) ; 17.36,27.21 17.36,25.69 16.85,25.18 16.85,24.3 U2.21
  Top Layer w0.254: R14.2 6.97,32.01 v1(16.07,32.01) ; C9.2 17.84,33.53 LDO1.5 ; R9.1 28.46,22.99 28.46,20.37 C14.1
  Bottom Layer w0.2: v1(16.07,32.01) 16.07,30.53 v1(17.36,29.24)
24_SCL: length 47.6
  Top Layer w0.2: v1(24.19,22.04) 23.94,21.79 U2.11 ; 54.75,17.4 48.63,23.51 47.11,23.51 v1(45.86,24.77)
  Top Layer w0.254: R12.1 53.98,16.13 54.75,16.89 54.75,17.4 SK1.14
  Bottom Layer w0.2: v1(45.86,24.77) 45.09,24 33.41,24 32.14,25.27 27.42,25.27 v1(24.19,22.04)
24_SDA: length 47.8
  Top Layer w0.2: v1(22.99,22.44) 22.73,22.19 U2.12 ; SK1.13 v1(49.66,20.07)
  Top Layer w0.254: R11.1 50.55,15.88 SK1.13
  Bottom Layer w0.2: v1(49.66,20.07) 48.39,21.34 48.39,25.49 47.63,26.25 26.8,26.25 v1(22.99,22.44)
25_MISO: length 28.1
  Top Layer w0.2: v1(27.39,23.79) U2.15
  Bottom Layer w0.2: SK1.6 45.59,23.62 27.56,23.62 v1(27.39,23.79)
25_MOSI: length 26.1
  Top Layer w0.2: U2.16 19.36,24.2 19.71,24.55 v1(27.64,24.55) ; v1(32.22,24.3) 38.99,17.53 SK1.9
  Bottom Layer w0.2: v1(27.64,24.55) 27.9,24.3 v1(32.22,24.3)
25_SCK: length 26.6
  Top Layer w0.2: U2.14 20.94,23.37 26.04,23.37 v1(26.54,22.86)
  Bottom Layer w0.2: v1(26.54,22.86) 39.24,22.86 SK1.10
25_SCS0: length 31.4
  Top Layer w0.2: U2.13 21.83,22.59 v1(21.99,22.75)
  Bottom Layer w0.2: v1(21.99,22.75) 25.91,26.67 48.13,26.67 SK1.5
D+: length 12.8
  Top Layer w0.254: U2.28 16.54,20.61 15.74,20.61 15.58,20.45 8.01,20.45 7.8,20.66 6.61,20.66 USB1.B6 6.47,20.66 5.77,20.66 5.61,20.82 5.61,21.35 5.77,21.52 6.47,21.52 USB1.A6
D-: length 12.8
  Top Layer w0.254: U2.27 16.54,20.97 15.59,20.97 15.43,20.8 8.15,20.8 7.94,21.02 6.61,21.02 USB1.A7 ; 6.59,21.03 6.66,21.09 7.3,21.09 7.47,21.26 7.47,21.85 7.22,22.1 6.55,22.1 USB1.B7
ENABLE_1.8V: length 68.2
  Top Layer w0.254: U3.3 27.62,30.42 27.01,29.82 24.98,29.82 v1(24.47,30.32) ; SW2.3 14.38,5.42 R8.2 3.45,4.69 2.14,4.69 1.89,4.94 1.89,5.96 2.65,6.72 3.41,6.72 R7.2 4.68,7.48 v1(4.94,7.23)
  Bottom Layer w0.254: v1(4.94,7.23) 8.49,10.79 8.49,30.6 10.5,32.61 22.19,32.61 v1(24.47,30.32)
ENABLE_3.3V: length 66.1
  Top Layer w0.254: R6.2 3.45,10.64 2.14,10.64 ; v1(4.25,16.5) 4.25,13.51 R5.2 3.41,12.67 2.65,12.67 1.89,11.91 1.89,10.9 2.14,10.64 ; 2.14,10.64 1.38,9.88 1.38,4.8 3.49,2.69 SW2.1 ; LDO2.3 23.56,29.96 v1(23.81,29.71)
  Bottom Layer w0.254: v1(23.81,29.71) 24.83,29.71 25.08,29.96 25.08,30.72 22.54,33.26 10.35,33.26 4.25,27.17 v1(4.25,16.5)
J_SRST: length 83.2
  Top Layer w0.2: U2.8 20.81,20.34 v1(22.72,20.34) ; v1(9.65,30.86) 8.89,30.1 4.28,30.1 LED4.1
  Bottom Layer w0.2: v1(9.65,30.86) 9.65,30.61 16.76,23.5 16.76,22.23 20.57,18.42 23.37,18.42 24.13,19.18 ; 68.83,3.68 56.13,16.38 44.2,16.38 43.18,17.4 43.18,17.91 42.42,18.67 25.15,18.67 24.64,19.18 24.13,19.18 ; v1(22.72,20.34) 23.88,19.18 24.13,19.18
J_TCK: length 62.3
  Top Layer w0.2: U2.23 15.93,22.59 15.58,22.94 v1(15.03,22.94)
  Bottom Layer w0.2: 63.75,3.68 62.48,2.41 32,2.41 14.02,20.4 14.02,21.92 v1(15.03,22.94)
J_TDI: length 61.6
  Top Layer w0.2: U2.25 15.65,21.79 15.47,21.97 13.18,21.97 v1(12.93,21.72) ; 56.13,3.68 54.86,2.41 22.47,2.41 v1(16.63,8.26)
  Bottom Layer w0.2: v1(16.63,8.26) 14.6,10.29 14.09,10.29 12.93,11.45 v1(12.93,21.72)
J_TDO: length 66.6
  Top Layer w0.2: v1(12.31,22.19) 12.49,22.37 15.61,22.37 15.8,22.19 U2.24 ; 58.67,3.68 56.9,1.91 22.18,1.91 v1(15.8,8.29)
  Bottom Layer w0.2: v1(12.31,22.19) 12.31,10.76 14.78,8.29 v1(15.8,8.29)
J_TMS: length 54.7
  Top Layer w0.2: v1(15.21,21.41) 16.53,21.41 U2.26
  Bottom Layer w0.2: v1(15.21,21.41) 17.07,21.41 20.57,17.91 40.13,17.91 42.16,15.88 49.02,15.88 61.21,3.68
J_TRST: length 71.7
  Top Layer w0.2: U2.9 24.62,20.99 v1(28.83,16.79) ; v1(24.37,16.79) 23.61,16.02 v1(22.08,16.02) ; v1(30.28,3.14) 30.28,5.79 v1(21.07,15.01)
  Bottom Layer w0.2: v1(30.28,3.14) 31.8,1.62 64.23,1.62 66.29,3.68 ; v1(21.07,15.01) v1(22.08,16.02) ; v1(24.37,16.79) v1(28.83,16.79)
RST#: length 23.9
  Top Layer w0.2: v1(18.41,17.5) 18.16,17.76 U2.3 ; v1(30.98,17.25) 29.96,18.27 29.96,22.99
  Top Layer w0.254: C11.1 29.27,22.3 R9.2
  Bottom Layer w0.2: v1(30.98,17.25) 30.73,17.5 v1(18.41,17.5)
U0_CTS: length 32.3
  Top Layer w0.2: v1(19.14,24.98) 18.96,24.81 U2.17 ; H4.4 v1(25.15,19.56)
  Bottom Layer w0.2: v1(19.14,24.98) 19.64,24.48 19.64,24.3 24.38,19.56 v1(25.15,19.56)
U0_DTR: length 30.5
  Top Layer w0.2: H4.5 25.85,21.39 U2.10
U0_RTS: length 32.1
  Top Layer w0.2: H4.3 v1(23.11,19.05) ; U2.18 18.54,23.81 v1(18.54,25.55)
  Bottom Layer w0.2: v1(18.54,25.55) 18.54,23.62 v1(23.11,19.05)
U0_RX: length 32.8
  Top Layer w0.2: U2.22 16.18,23.37 v1(16,23.37)
  Bottom Layer w0.2: H4.2 22.86,16.76 18.29,16.76 14.48,20.57 14.48,21.59 16,23.11 v1(16,23.37)
U0_TX: length 29
  Top Layer w0.2: U2.19 18.16,24.64 v1(17.9,24.89) ; v1(20.83,19.05) 20.83,16.26 H4.1
  Bottom Layer w0.2: v1(20.83,19.05) 17.9,21.97 v1(17.9,24.89)
U1_RX: length 19.2
  Top Layer w0.2: H5.2 26.04,8.38 19.43,14.99 19.43,18.03 18.96,18.51 U2.5
U1_TX: length 18.3
  Top Layer w0.2: U2.4 18.56,18.29 19.07,17.78 19.07,14.73 23.5,10.3 H5.1
USBC-5V: length 16.3
  Top Layer w0.254: 5.47,23.5 4.96,23.5 4.45,24 4.45,26.29 7.5,29.34 F1.1 ; 5.47,23.5 5.72,23.75 6.4,23.75 ; 5.47,23.5 4.96,22.99 4.96,19.94 5.81,19.09 USB1.B4 USB1.A9 ; 6.4,23.75 6.4,23.72 USB1.B9 ; 6.4,23.75 USB1.A4
VIO: length 149.2
  Top Layer w0.2: U2.6 19.36,19.32 19.51,19.18 19.99,19.18 20.5,19.69 24.06,19.69 v1(24.57,20.19) ; v1(19.23,27.05) 26.09,27.05 28.38,24.77 28.38,23.75 26.6,21.97 v1(25.84,21.97) ; R10.1 34.04,19.43 v1(33.96,19.43)
  Top Layer w0.254: 61.46,9.65 60.19,9.65 60.06,9.78 R12.2 54.73,9.02 52.82,9.02 R11.2 51.3,9.02 49.9,9.02 49.14,9.78 ; 61.46,9.65 61.53,9.65 C15.1 ; 61.46,9.65 61.46,10.09 C16.1 62.3,15.05 SK1.16 ; 21.91,34.04 21.91,33.53 v1(20.39,32.01) ; 21.91,34.04 22.16,34.29 24.86,34.29 25.72,33.43 ; 21.91,34.04 21.91,34.54 21.65,34.8 21.65,35.81 ; C8.2 25.21,37.97 23.68,37.97 21.65,35.94 21.65,35.81 ; C13.1 12.51,28.83 v1(12.51,28.58) 12.51,27.69 C12.1 ; 49.14,9.78 R13.2 47.87,9.02 44.46,9.02 R10.1 ; 49.14,9.78 49.14,17.01 SK1.12 ; C5.2 21.65,35.81
  Bottom Layer w0.2: v1(33.96,19.43) 31.42,21.97 v1(25.84,21.97) 25.84,21.46 v1(24.57,20.19) ; 17.71,28.58 v1(19.23,27.05)
  Bottom Layer w0.254: v1(12.51,28.58) 17.71,28.58 20.39,31.25 v1(20.39,32.01) 23.43,28.97 36.23,28.97 H2.1 H2.2 H2.3
XI: length 13.1
  Top Layer w0.2: U2.1 17.36,16.27 14.49,13.4 14.23,13.4
  Top Layer w0.254: X1.1 12.89,13.4 14.23,13.4 15.76,11.87 C2.1
XO: length 16.3
  Top Layer w0.2: C1.2 17.76,13.65 U2.2
  Top Layer w0.254: C1.2 19.09,10.8 15.28,10.8 13.84,12.23 13.55,12.23
$1N3218: length 5.8
  Top Layer w0.254: USB1.A5 7.3,22.59 8.39,23.68 R1.1
$1N3257: length 5.7
  Top Layer w0.254: USB1.B5 6.6,19.53 7.36,19.53 9.39,17.5 R2.2
$1N4164: length 6.6
  Top Layer w0.254: LED2.2 7.09,12.26 3.56,12.26 2.67,11.37
$1N4166: length 6.7
  Top Layer w0.254: 2.67,5.42 3.48,6.23 6.9,6.23 8.42,7.75
$1N5733: length 16.2
  Top Layer w0.254: R10.2 45.85,10.42 45.85,23.88 SK1.7
$1N6054: length 7.8
  Top Layer w0.254: R13.1 47.13,17.52 SK1.11
$1N7010: length 3.7
  Top Layer w0.254: R14.1 5.12,32.36 LED4.2

## Text on the board
Top Silkscreen Layer: Version 1.0 / Jazzzny | 3.3V | 1.8V | 5V | 25XX | VIO | 24XX | GND | UART 1 | TX | RX | UART 0 | RTS | CTS | DTR | JTAG | TDI | TDO | TMS | TCK | TRST | SRST | CH347F-Based | EEPROM Programmer
